# Altium project SmartHive_Client.PrjPcb
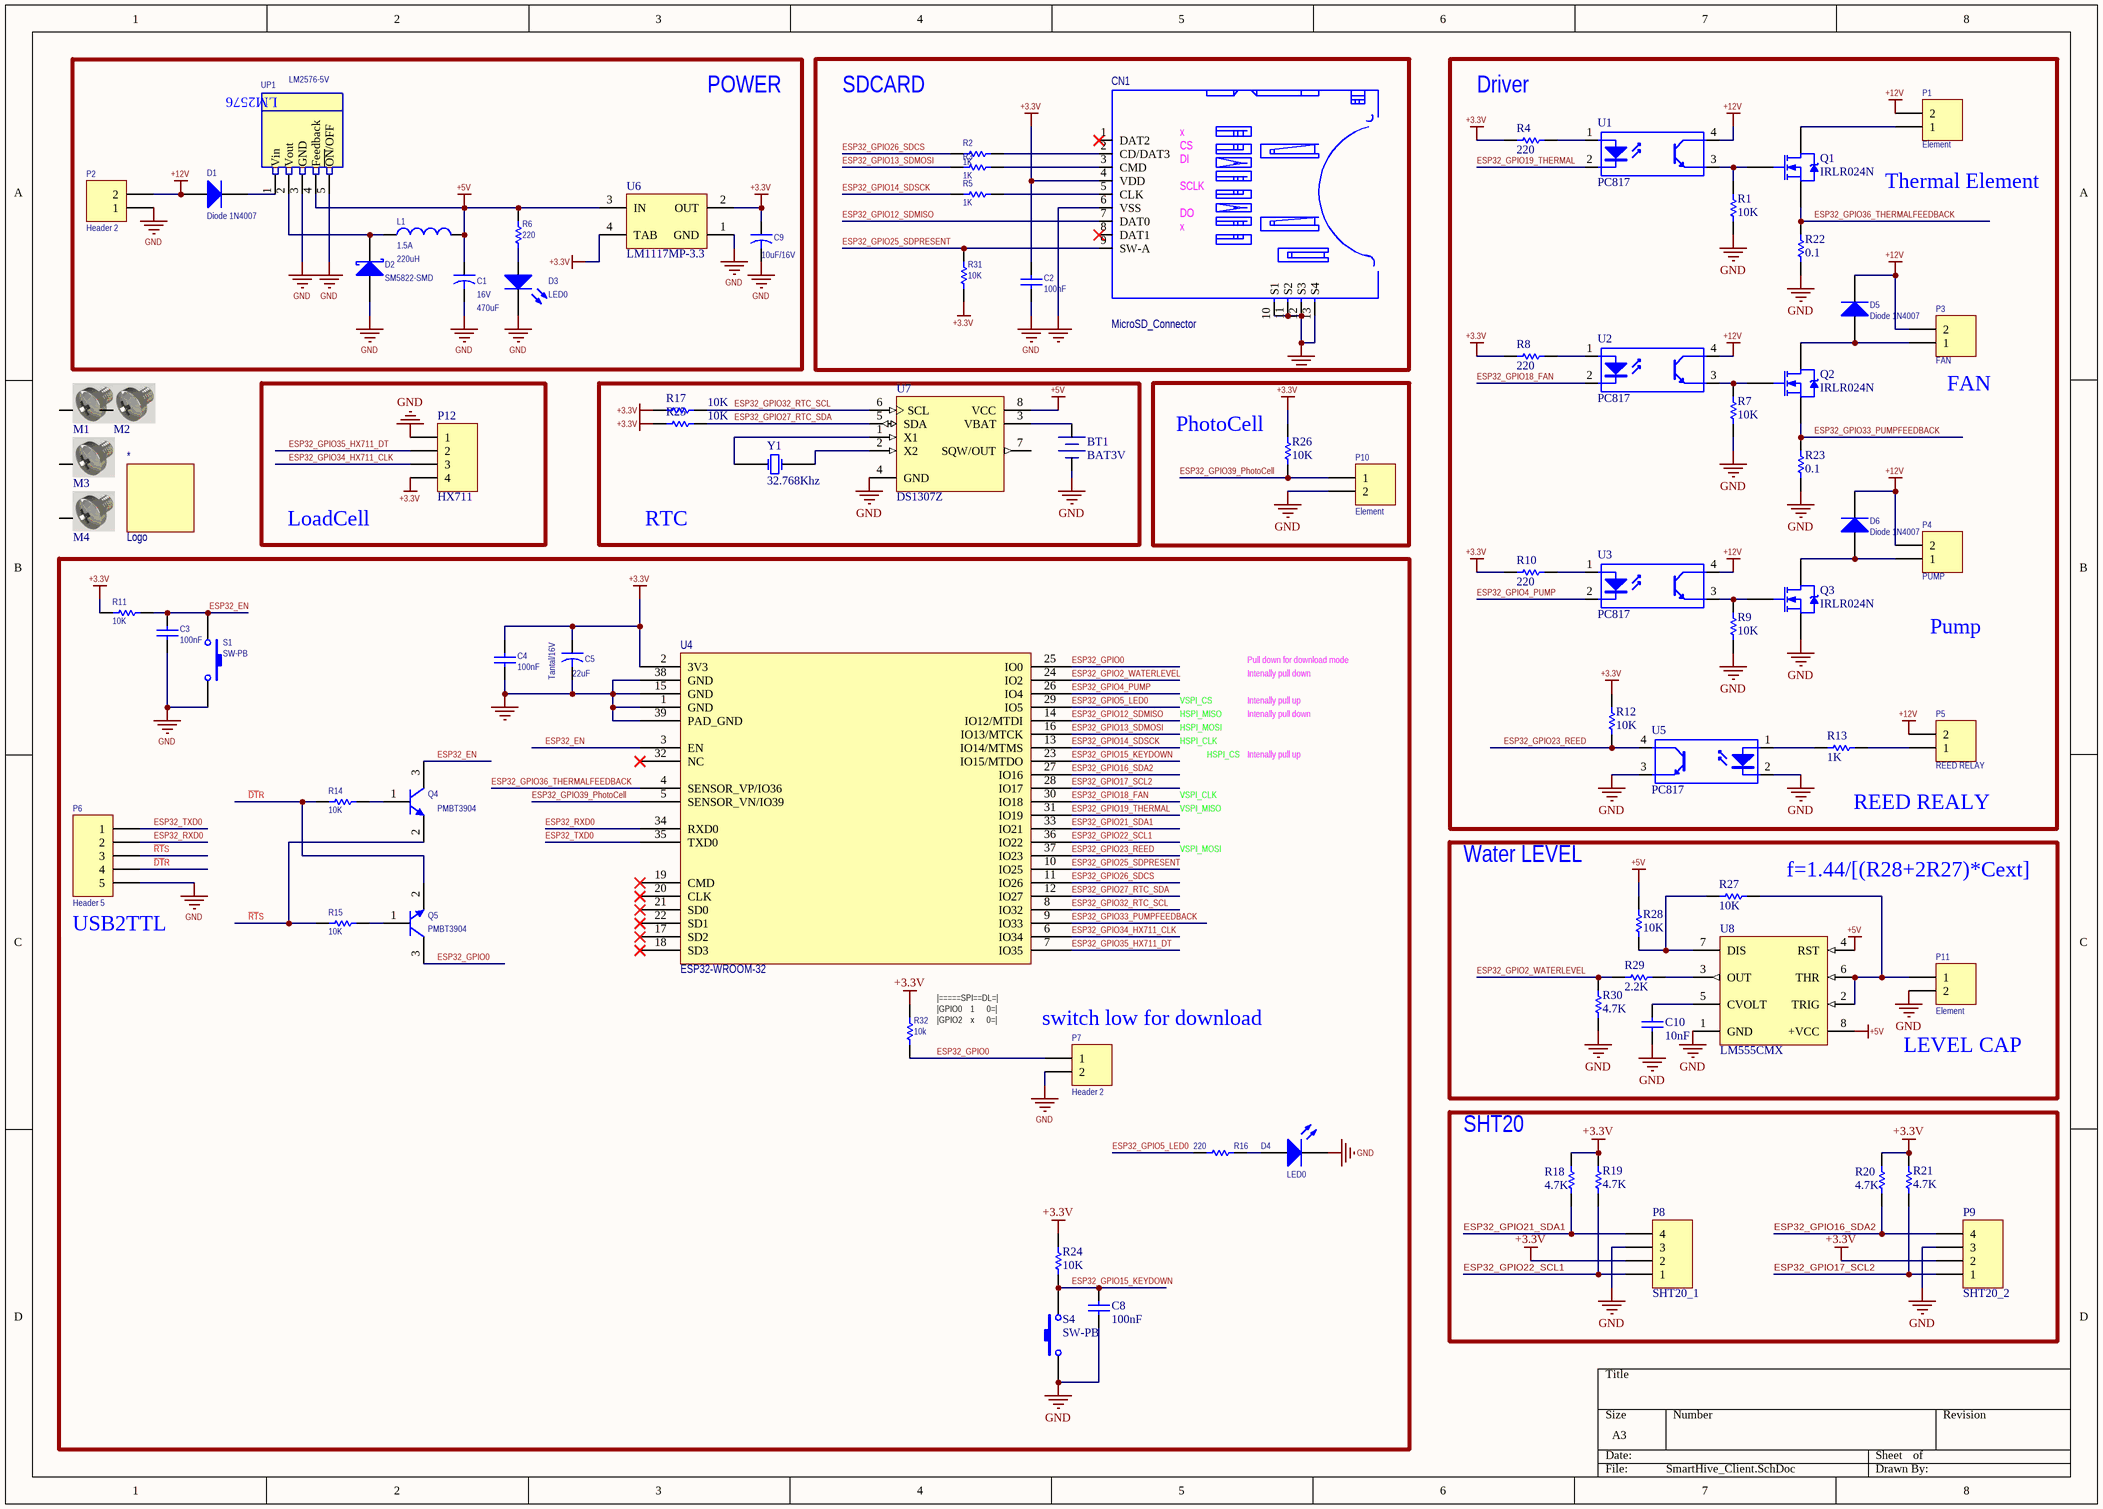
[diagram p0: SmartHive_Client.SchDoc]
1 sheet, 83 parts. Net scope: global (net labels, ports and power ports of the same name join across sheets).
Board file: SmartHive_Client.PcbDoc

## Sheet SmartHive_Client.SchDoc
size A3

### Parts
*  Logo  [LOGO_PARS_TOP]
BT1  BAT3V  [BTH2032_DIP]
C1  16V  value 470uF  [Cap electrolitic radial 8x12-3.5]
C2  100nF  [CAP0805]
C3  100nF  [CAP0805]
C4  100nF  [CAP0805]
C5  Tantal/16V  value 22uF  [CAP_TANTAL_TYPE_B]
C8  100nF  [CAP0805]
C9  10uF/16V  [Cap electrolitic radial 5x11-2]
C10  10nF  [CAP0805]
CN1  MicroSD_Connector  [MICRO_SD_TFP-09-2-12B]
D1  Diode 1N4007  [DO-241AC]
D2  SM5822-SMD  [430X270D]
D3  LED0  [LED5MM_GRN]
D4  LED0  [LED5MM_BLUE]
D5  Diode 1N4007  [DO-241AC]
D6  Diode 1N4007  [DO-241AC]
L1  1.5A  value 220uH  [Inductor 10x12 (200 mils)]
M1  Screw3mm  [Board Screw 3mm]  (value not drawn)
M2  Screw3mm  [Board Screw 3mm]  (value not drawn)
M3  Screw3mm  [Board Screw 3mm]  (value not drawn)
M4  Screw3mm  [Board Screw 3mm]  (value not drawn)
P1  Element  [MSTBV 2,5/2-G-5]
P2  Header 2  [MSTBV 2,5/2-G-5]
P3  FAN  [MSTBV 2,5/2-G-5]
P4  PUMP  [MSTBV 2,5/2-G-5]
P5  REED RELAY  [MSTBV 2,5/2-G-5]
P6  Header 5  [HDR1X5]
P7  Header 2  [Jumper Small - 2.54 - Black]
P8  SHT20_1  [XH-4PIN]
P9  SHT20_2  [XH-4PIN]
P10  Element  [DS1070-2-COMCON]
P11  Element  [DS1070-2-COMCON]
P12  HX711  [HDR1X4]
Q1  IRLR024N  [TO252-3M]
Q2  IRLR024N  [TO252-3M]
Q3  IRLR024N  [TO252-3M]
Q4  PMBT3904  [SOT23_M]
Q5  PMBT3904  [SOT23_M]
R1  10K  [RES0805]
R2  1K  [RES0805]
R3  1K  [RES0805]
R4  220  [RES0805]
R5  1K  [RES0805]
R6  220  [RES0805]
R7  10K  [RES0805]
R8  220  [RES0805]
R9  10K  [RES0805]
R10  220  [RES0805]
R11  10K  [RES0805]
R12  10K  [RES0805]
R13  1K  [RES0805]
R14  10K  [RES0805]
R15  10K  [RES0805]
R16  220  [RES0805]
R17  10K  [RES0805]
R18  4.7K  [RES0805]
R19  4.7K  [RES0805]
R20  4.7K  [RES0805]
R21  4.7K  [RES0805]
R22  0.1  [RES2512]
R23  0.1  [RES2512]
R24  10K  [RES0805]
R25  10K  [RES0805]
R26  10K  [RES0805]
R27  10K  [RES0805]
R28  10K  [RES0805]
R29  2.2K  [RES0805]
R30  4.7K  [RES0805]
R31  10K  [RES0805]
R32  10k  [RES0805]
S1  SW-PB  [SW-2PIN-SMD]
S4  SW-PB  [SW-4PIN]
U1  PC817  [DIP_4]
U2  PC817  [DIP_4]
U3  PC817  [DIP_4]
U4  ESP32-WROOM-32  [ESP32-WROOM-32D]
U5  PC817  [DIP_4]
U6  LM1117MP-3.3  [SOT223_4]
U7  DS1307Z  [SO-8N]
U8  LM555CMX  [SO-8N]
UP1  LM2576-5V  [TO-220_5 with heatsink HS sot32]
Y1  32.768Khz  [Crystal_NC308]

### Blocks framed on the sheet
POWER: C1 C9 D1-D3 L1 P2 R6 U6 UP1
SDCARD: C2 CN1 R2 R3 R5 R31
Driver: D5 D6 P1 P3-P5 Q1-Q3 R1 R4 R7-R10 R12 R13 R22 R23 U1-U3 U5
Water LEVEL: C10 P11 R27-R30 U8
SHT20: P8 P9 R18-R21

### Nets
+3.3V: C2.2 C4.2 C5.1 C9.1 CN1.4(VDD) P8.2 P9.2 P12.4 R4.1 R8.1 R10.1 R11.2 R12.2 R17.2 R18.2 R19.2 R20.2 R21.2 R24.2 R25.2 R26.2 R31.2 R32.2 U4.2(3V3) U6.2(OUT) U6.4(TAB)
+5V: C1.1 L1.2 R6.2 R28.2 U6.3(IN) U7.8(VCC) U8.4(RST) U8.8(+VCC) UP1.4(Feedback)
+12V: D1.1(A) D5.2(K) D6.2(K) P1.2 P2.2 P3.2 P4.2 P5.2 U1.4(C) U2.4(C) U3.4(C)
GND: BT1.2(-) C1.2 C2.1 C3.1 C4.1 C5.2 C8.1 C9.2 C10.1 CN1.6(VSS) CN1.10(S1) CN1.11(S2) CN1.12(S3) CN1.13(S4) D2.1(A) D3.2(K) D4.2(K) P2.1 P6.5 P7.2 P8.3 P9.3 P10.2 P11.2 P12.1 Q3.3(S) R1.1 R7.1 R9.1 R22.1 R23.1 R30.1 S1.2 S4.2 U4.1(GND) U4.15(GND) U4.38(GND) U4.39(PAD_GND) U5.2(K) U5.3(E) U6.1(GND) U7.4(GND) U8.1(GND) UP1.3(GND) UP1.5(~{ON}/OFF)
~{DT}R: P6.4 Q5.2(E) R14.2
~{RT}S: P6.3 Q4.2(E) R15.2
ESP32_EN: C3.2 Q4.3(C) R11.1 S1.1 U4.3(EN)
ESP32_GPIO0: P7.1 Q5.3(C) R32.1 U4.25(IO0)
ESP32_GPIO2_WATERLEVEL: R29.2 R30.2 U4.24(IO2)
ESP32_GPIO4_PUMP: U3.2(K) U4.26(IO4)
ESP32_GPIO5_LED0: R16.1 U4.29(IO5)
ESP32_GPIO12_SDMISO: CN1.7(DAT0) U4.14(IO12/MTDI)
ESP32_GPIO13_SDMOSI: R3.2 U4.16(IO13/MTCK)
ESP32_GPIO14_SDSCK: R5.2 U4.13(IO14/MTMS)
ESP32_GPIO15_KEYDOWN: C8.2 R24.1 S4.1 U4.23(IO15/MTDO)
ESP32_GPIO16_SDA2: P9.4 R20.1 U4.27(IO16)
ESP32_GPIO17_SCL2: P9.1 R21.1 U4.28(IO17)
ESP32_GPIO18_FAN: U2.2(K) U4.30(IO18)
ESP32_GPIO19_THERMAL: U1.2(K) U4.31(IO19)
ESP32_GPIO21_SDA1: P8.4 R18.1 U4.33(IO21)
ESP32_GPIO22_SCL1: P8.1 R19.1 U4.36(IO22)
ESP32_GPIO23_REED: R12.1 U4.37(IO23) U5.4(C)
ESP32_GPIO25_SDPRESENT: CN1.9(SW-A) R31.1 U4.10(IO25)
ESP32_GPIO26_SDCS: R2.2 U4.11(IO26)
ESP32_GPIO27_RTC_SDA: R25.1 U4.12(IO27) U7.5(SDA)
ESP32_GPIO32_RTC_SCL: R17.1 U4.8(IO32) U7.6(SCL)
ESP32_GPIO33_PUMPFEEDBACK: Q2.3(S) R23.2 U4.9(IO33)
ESP32_GPIO34_HX711_CLK: P12.3 U4.6(IO34)
ESP32_GPIO35_HX711_DT: P12.2 U4.7(IO35)
ESP32_GPIO36_THERMALFEEDBACK: Q1.3(S) R22.2 U4.4(SENSOR_VP/IO36)
ESP32_GPIO39_PhotoCell: P10.1 R26.1 U4.5(SENSOR_VN/IO39)
ESP32_RXD0: P6.2 U4.34(RXD0)
ESP32_TXD0: P6.1 U4.35(TXD0)
NetBT1_1: BT1.1(+) U7.3(VBAT)
NetC10_2: C10.2 U8.5(CVOLT)
NetCN1_2: CN1.2(CD/DAT3) R2.1
NetCN1_3: CN1.3(CMD) R3.1
NetCN1_5: CN1.5(CLK) R5.1
NetD1_2: D1.2(K) UP1.1(Vin)
NetD2_2: D2.2(K) L1.1 UP1.2(Vout)
NetD3_1: D3.1(A) R6.1
NetD4_1: D4.1(A) R16.2
NetD5_1: D5.1(A) P3.1 Q2.4(D)
NetD6_1: D6.1(A) P4.1 Q3.4(D)
NetP1_1: P1.1 Q1.4(D)
NetP5_1: P5.1 R13.2
NetP11_1: P11.1 R27.1 U8.2(TRIG) U8.6(THR)
NetQ1_1: Q1.1(G) R1.2 U1.3(E)
NetQ2_1: Q2.1(G) R7.2 U2.3(E)
NetQ3_1: Q3.1(G) R9.2 U3.3(E)
NetQ4_1: Q4.1(B) R14.1
NetQ5_1: Q5.1(B) R15.1
NetR4_2: R4.2 U1.1(A)
NetR8_2: R8.2 U2.1(A)
NetR10_2: R10.2 U3.1(A)
NetR13_1: R13.1 U5.1(A)
NetR27_2: R27.2 R28.1 U8.7(DIS)
NetR29_1: R29.1 U8.3(OUT)
NetU7_1: U7.1(X1) Y1.1(OSC1)
NetU7_2: U7.2(X2) Y1.2(OSC2)

Not connected (* = marked no-connect by the designer): CN1 1(DAT2)* 8(DAT1)*; M1 S; M2 S; M3 S; M4 S; U4 17(SD2)* 18(SD3)* 19(CMD)* 20(CLK)* 21(SD0)* 22(SD1)* 32(NC)*; U7 7(SQW/OUT)

### Notes on the sheet
- (near CN1) x
- (near CN1) CS
- (near CN1) DI
- (near CN1) SCLK
- (near CN1) DO
- (near P1) Thermal Element
- (near R26) PhotoCell
- (near P3) FAN
- LoadCell
- RTC
- Pump
- VSPI_CS
- HSPI_MISO
- Intenally pull down
- Pull down for download mode
- Intenally pull up
- HSPI_MOSI
- HSPI_CLK
- HSPI_CS
- VSPI_MOSI
- VSPI_MISO
- VSPI_CLK
- REED REALY
- (near R27) f=1.44/[(R28+2R27)*Cext]
- (near P6) USB2TTL
- |=====SPI==DL=|
  |GPIO0    1      0=|
  |GPIO2    x      0=|
  |=============|
- (near P7) switch low for download
- LEVEL CAP
- (in symbol LM2576-Adj) LM2576

### Library data of the parts
BT1 = Battry Backup: Designer: Abbas Basereh; Data: 16-12-2016; Link: *; Part. No: *
C1 C5 C9 = Cap2: Capacitor; Published: 23-Sep-2002; PackageReference: CAPR5-4X5; Publisher: Altium Limited; PackageDescription: Capacitor; 2 Leads
  C9: Value: 10uF/16V
C2-C4 C8 C10 = Cap: Capacitor; Published: 8-Jun-2000; LatestRevisionDate: 17-Jul-2002; LatestRevisionNote: Re-released for DXP Platform.; PackageReference: RAD-0.3; Publisher: Altium Limited; PackageDescription: Radial Cap, Thru-Hole; 2 Leads; 0.3 in Pin Spacing
  C2-C4 C8: Value: 100nF
  C10: Value: 10nF
D1 D5 D6 = Diode 1N4007: 1 Amp General Purpose Rectifier; Published: 8-Jun-2000; LatestRevisionDate: 17-Jul-2002; LatestRevisionNote: Re-released for DXP Platform.; DatasheetVersion: 1998; PackageVersion: Aug-1999; PackageReference: DO-41; Publisher: Altium Limited; PackageDescription: Diode, Axial; Body 5.2 x 2.7 mm (LxDia. max), Lead Dia. 0.86 mm (max); Code_JEDEC: DO-204-AL; ComponentLink1Description: Manufacturer Link; ComponentLink1URL: http://www.fairchildsemi.com/; ComponentLink2Description: Datasheet; ComponentLink2URL: http://www.fairchildsemi.com/ds/1N%2F1N4001.pdf
D2 = D Schottky: Schottky Diode; Parameter 1: 1n5822; Published: 8-Jun-2000; LatestRevisionDate: 17-Jul-2002; LatestRevisionNote: Re-released for DXP Platform.; PackageReference: SMB; Publisher: Altium Limited; PackageDescription: DO-214-AA/SMB; 2 C-Bend Leads; Body 5.3 x 3.6 mm, inc. leads (LxW); Code_JEDEC: DO-214-AA
D3 D4 = LED0: Typical INFRARED GaAs LED; Published: 8-Jun-2000; LatestRevisionDate: 08-Jul-2005; LatestRevisionNote: Mech Layer 1 removed.; PackageReference: LED-0; Publisher: Altium Limited; PackageDescription: LED; 2 Leads
L1 = Inductor: Code_IEC: 1005; Published: 8-Jun-2000; LatestRevisionDate: 29-May-2009; LatestRevisionNote: IPC-7351 Footprint Added.; PackageReference: 0402-A; Publisher: Altium Limited; PackageDescription: Chip Inductor; Code_JEITA: 0402
M1-M4 = Board Screw 3mm: Board Screw With Spacer 3mm; Designer: Abbas Basereh; Data: 16-12-2016; Link: *; Part. No: *
P1-P5 P7 P10 P11 = Header 2: Header, 2-Pin; LatestRevisionDate: 17-Jul-2002; LatestRevisionNote: Re-released for DXP Platform.; Publisher: Altium Limited
P6 = Header 5: Header, 5-Pin; LatestRevisionDate: 17-Jul-2002; LatestRevisionNote: Re-released for DXP Platform.; Publisher: Altium Limited
P8 P9 P12 = Header 4: Header, 4-Pin; LatestRevisionDate: 17-Jul-2002; LatestRevisionNote: Re-released for DXP Platform.; Publisher: Altium Limited
Q1-Q3 = IRLR024N: HEXFET Power MOSFET; Note: Pin 2 is trimmed and is electrically connected to Drain.; Published: 8-Jun-2000; LatestRevisionDate: 20-Nov-2009; LatestRevisionNote: IPC-7351 Footprint Added.; PackageVersion: Feb-2003; PackageReference: TO-252AA; Publisher: Altium Limited; PackageDescription: 3-Pin HEXFET Package 2.28 mm Pitch, 9.9 mm Lead Span; Code_JEDEC: TO-252-AA; ComponentLink1Description: Manufacturer Link; ComponentLink1URL: http://www.irf.com/; ComponentLink2Description: Datasheet; ComponentLink2URL: http://www.irf.com/product-info/datasheets/data/irlr024n.pdf
Q4 Q5 = PMBT3904: NPN Switching Transistor; Published: 17-Sep-2003; LatestRevisionDate: 12-Dec-2006; LatestRevisionNote: IPC-7351 Footprint Added.; DatasheetVersion: 27-Apr-1999; PackageVersion: May-1999; PackageReference: SOT23; Publisher: Altium Limited; PackageDescription: 3-Pin SOT-23 Package 0.95 mm Pitch, 2.3 mm Lead Span; ComponentLink1Description: Manufacturer Link; ComponentLink1URL: http://www.semiconductors.philips.com/; ComponentLink2Description: Datasheet; ComponentLink2URL: http://www.semiconductors.philips.com/acrobat/datasheets/PMBT3904_4.pdf
R1-R21 R24-R32 = Res1: Resistor; Published: 8-Jun-2000; LatestRevisionDate: 17-Jul-2002; LatestRevisionNote: Re-released for DXP Platform.; PackageReference: AXIAL-0.3; Publisher: Altium Limited; PackageDescription: Axial Device, Thru-Hole; 2 Leads; 0.3 in Pin Spacing
  R1 R7 R9 R11 R12 R14 R15 R17 R24-R28 R31: Value: 10K
  R2 R3 R5 R13: Value: 1K
  R4 R6 R8 R10 R16: Value: 220
  R18-R21 R30: Value: 4.7K
  R29: Value: 2.2K
  R32: Value: 10k
R22 R23 = Res1: Size:2512,1%; Published: 8-Jun-2000; LatestRevisionDate: 17-Jul-2002; LatestRevisionNote: Re-released for DXP Platform.; PackageReference: AXIAL-0.3; Publisher: Altium Limited; PackageDescription: Axial Device, Thru-Hole; 2 Leads; 0.3 in Pin Spacing; Value: 0.1
S1 S4 = SW-PB: Switch; Published: 24-Mar-1999; LatestRevisionDate: 17-Jul-2002; LatestRevisionNote: Re-released for DXP Platform.; PackageReference: SPST-2; Publisher: Altium Limited; PackageDescription: Switch; 2 Leads
U1-U3 U5 = Optoisolator1: 4-Pin Phototransistor Optocoupler; Published: 24-Mar-1999; LatestRevisionDate: 04-Mar-2005; LatestRevisionNote: Sch pins 3 & 4 Swapped.; DatasheetVersion: Nov-2003; PackageReference: DIP-4; Publisher: Altium Limited
U4 = ESP32-WROOM-32: ESP32  a single chip 2.4 GHz Wi-Fi and Bluetooth combo chip
U6 = LM1117MP-3.3: 800mA Low-Dropout Linear Regulator, 4-pin SOT-223; Manufacturer: National Semiconductor; PackageTopMarking: XYTT*N05A; PowerWise: N; CompType: LDO IC; Published: 4-Dec-2008; DatasheetVersion: Apr-2006; PackageVersion: revB, Apr-2003; PackageReference: MP04A; Publisher: Altium Limited; PackageDescription: Molded SOT-223, 6.50 x 3.56 x 1.6mm Body, 4 Lead, 2.3mm Pitch; Supplier 1: Farnell; Supplier Part Number 1: 9778195; Supplier 2: Farnell; Supplier Part Number 2: 9778195RL; PartNumber: LM1117MP-3.3; RoHS: N; PinCount: 4; Code_JEDEC: TO-261-AA; Code_IPC: SOT223-4; ComponentLink1Description: LM1117 Datasheet; ComponentLink1URL: http://www.national.com/ds/LM/LM1117.pdf; ComponentLink2Description: LM1117 Web Page; ComponentLink2URL: http://www.national.com/pf/LM/LM1117.html; ComponentLink3Description: MP04A Package Page; ComponentLink3URL: http://www.national.com/packaging/folders/mp04a.html
U7 = DS1307Z: 64 X 8 Serial Real-Time Clock; Published: 13-Oct-2000; LatestRevisionDate: 13-Apr-2006; LatestRevisionNote: IPC-7351 Footprint Added.; DatasheetVersion: 10-Aug-1999; PackageVersion: 1999; PackageReference: SOIC8N; Publisher: Altium Limited; PackageDescription: 8-Pin Small Outline Integrated Circuit 1.27 mm Pitch; Code_IPC: SOIC127P600-8; ComponentLink1Description: Manufacturer Link; ComponentLink1URL: http://www.maxim-ic.com/; ComponentLink2Description: Datasheet; ComponentLink2URL: http://pdfserv.maxim-ic.com/en/ds/DS1307.pdf; ComponentLink3Description: Discontinuation Notice; ComponentLink3URL: http://www.maxim-ic.com/qa/pdfs/non-obsolescence-letter.pdf
U8 = LM555CMX: Timer, 8-pin Narrow SOIC; Manufacturer: National Semiconductor; PackageTopMarking: NSZXTT*LM*555CM; PowerWise: N; CompType: Analog IC; Published: 4-Dec-2008; DatasheetVersion: Jul-2006; PackageVersion: revM, May-2009; PackageReference: M08A; Publisher: Altium Limited; PackageDescription: SOIC Narrow, 4.9 x 3.9 x 1.45mm, 8 Lead, 1.27mm Pitch; PartNumber: LM555CMX; RoHS: N; PinCount: 8; Code_JEDEC: MS-012-AA; Code_IPC: SOIC127P600-8; ComponentLink1Description: LM555 Datasheet; ComponentLink1URL: http://www.national.com/ds/LM/LM555.pdf; ComponentLink2Description: LM555 Web Page; ComponentLink2URL: http://www.national.com/pf/LM/LM555.html; ComponentLink3Description: M08A Package Page; ComponentLink3URL: http://www.national.com/packaging/folders/m08a.html
UP1 = LM2576-Adj: 3.3V, 3A variable output step-down switching voltage regulator; Designer: Abbas Basereh; Data: 16-12-2016; Link: *; Part.No: *; VALUE: LM2576-5V
Y1 = XTAL_Crystal: XTAL Crystal; Designer: ABBAS BASEREH; Design Date: 2017-1-3; ComponentLink1Description: Datasheet; ComponentLink2Description: Reference; Mounting Technology: Surface Mount\Through-Hole; Value: 32.768Khz; Status: Unreleased